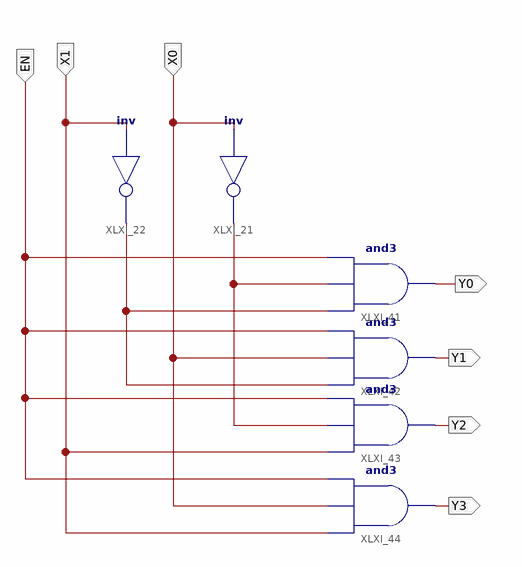
[diagram p0: schematic sheet 1]
// Xilinx ISE schematic Decoder2to4.sch (spartan3e) as structural Verilog: 6 symbols, 7 ports
module Decoder2to4 (
  input  X0,
  input  X1,
  input  EN,
  output Y2,
  output Y1,
  output Y3,
  output Y0
);

  wire XLXN_1, XLXN_11;

  not XLXI_21 (XLXN_1, X0);
  not XLXI_22 (XLXN_11, X1);
  and XLXI_42 (Y1, XLXN_11, X0, EN);
  and XLXI_43 (Y2, X1, XLXN_1, EN);
  and XLXI_41 (Y0, XLXN_11, XLXN_1, EN);
  and XLXI_44 (Y3, X1, X0, EN);
endmodule
